# Altium schematic sheet APP_1_Overview.SchDoc: Overview
size Tabloid; DocumentNumber: 2; SheetNumber: 2; SheetTotal: 13; Sheet_Name: Overview; Size: 11x17
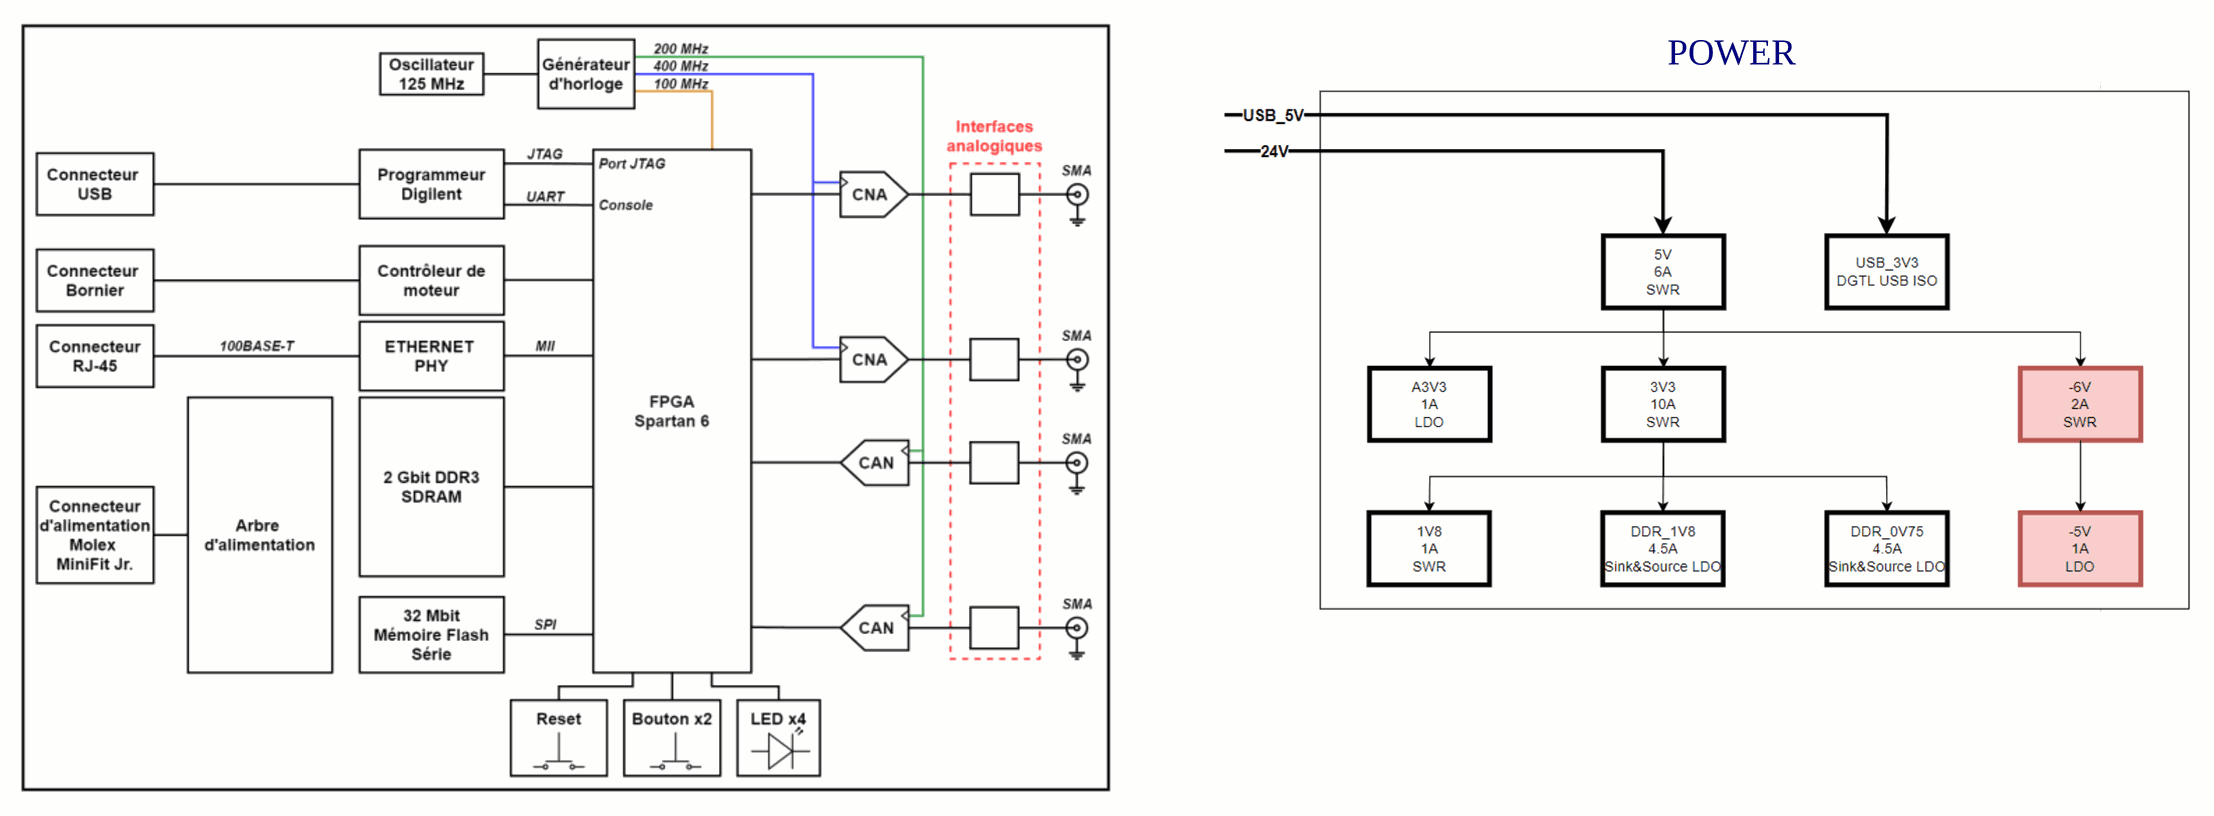
[diagram p0: APP_1_Overview.SchDoc]

## Notes on the sheet
- POWER
- Sheet Name
- Project Title
- Global Project
- Size
- Group
- Revision
- Date
- Sheet
- of
- Filename
- Designers